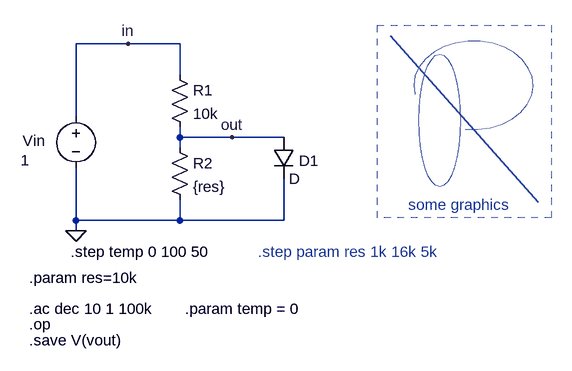
[diagram p0: schematic test_instructions_output_2.asc]
test_instructions_output_2.asc, the LTspice schematic file:
Version 4
SHEET 1 880 680
WIRE 208 80 128 80
WIRE 288 80 208 80
WIRE 288 128 288 80
WIRE 128 192 128 80
WIRE 288 224 288 208
WIRE 368 224 288 224
WIRE 448 224 368 224
WIRE 288 240 288 224
WIRE 128 352 128 272
WIRE 288 352 288 320
WIRE 288 352 128 352
WIRE 448 352 448 288
WIRE 448 352 288 352
WIRE 128 368 128 352
FLAG 128 368 0
FLAG 368 224 out
FLAG 208 80 in
SYMBOL voltage 128 176 R0
WINDOW 123 0 0 Left 0
WINDOW 39 0 0 Left 0
WINDOW 0 -82 53 Left 2
WINDOW 3 -85 83 Left 2
SYMATTR InstName Vin
SYMATTR Value 1
SYMBOL res 272 112 R0
SYMATTR InstName R1
SYMATTR Value 10k
SYMATTR SpiceLine tol=1% pwr=0.1
SYMBOL res 272 224 R0
SYMATTR InstName R2
SYMATTR Value {res}
SYMBOL diode 432 224 R0
WINDOW 0 39 36 Left 2
SYMATTR InstName D1
TEXT 56 488 Left 2 !.ac dec 10 1 100k
TEXT 56 440 Left 2 !.param res=10k
TEXT 120 400 Left 2 !.step temp 0 100 50
TEXT 408 400 Left 2 ;.step param res 1k 16k 5k
TEXT 56 512 Left 2 !.op
TEXT 296 488 Left 2 !.param temp = 0
TEXT 640 328 Left 2 ;some graphics
TEXT 56 536 Left 2 !.save V(vout)
LINE Normal 612 68 840 324
RECTANGLE Normal 592 52 860 348 2
CIRCLE Normal 720 96 656 300 4
ARC Normal 648 76 832 212 712 296 612 164 3

The netlist it stands for:
* test_instructions_output_2.asc
Vin in 0 1
R1 in out 10k tol=1% pwr=0.1
R2 out 0 {res}
D1 out 0 D
.model D D
.lib standard.dio
.ac dec 10 1 100k
.param res=10k
.step temp 0 100 50
* .step param res 1k 16k 5k
.op
.param temp = 0
* some graphics
.save V(vout)
.backanno
.end